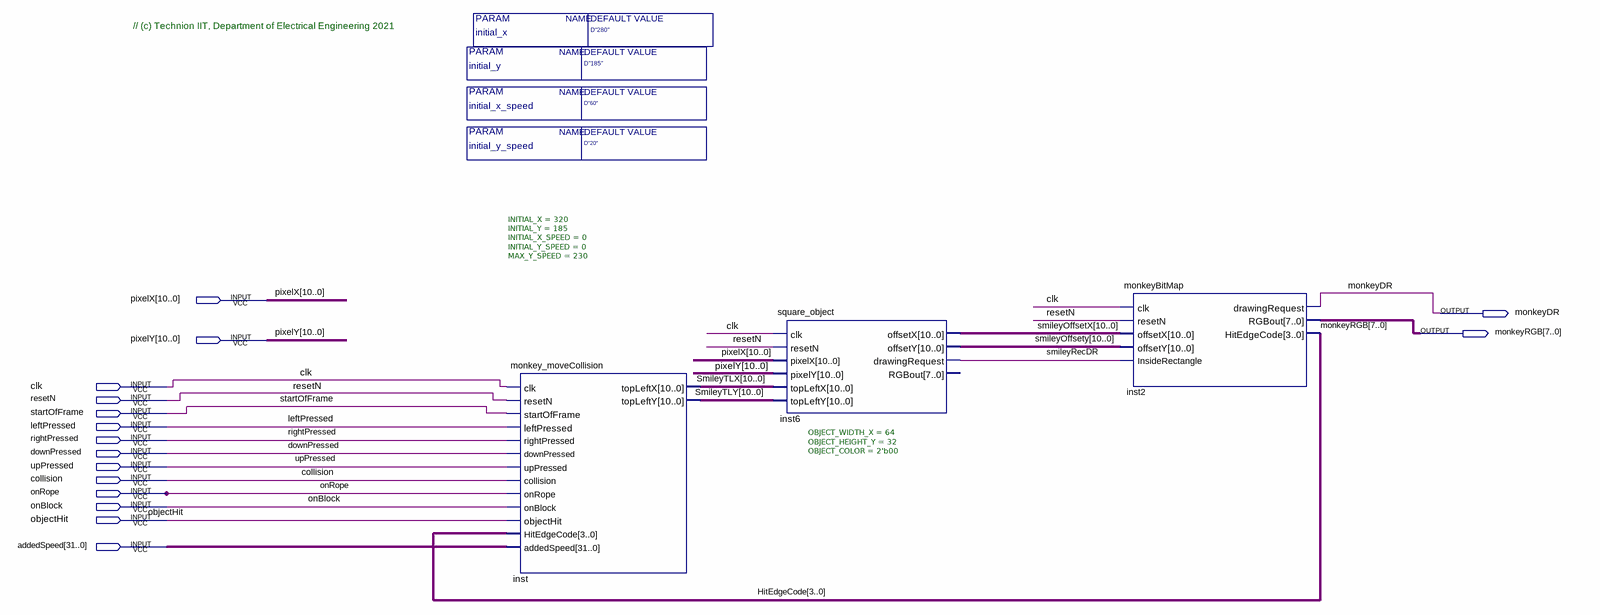
[diagram p0: schematic sheet]
// Quartus schematic monkey_block.bdf as structural Verilog: 3 symbols, 16 pins
module monkey_block #(parameter initial_x = "D\"280\"", parameter initial_y = "D\"185\"", parameter initial_x_speed = "D\"60\"", parameter initial_y_speed = "D\"20\"") (
  input  [10:0] pixelX,
  input  [10:0] pixelY,
  input  clk,
  input  resetN,
  input  startOfFrame,
  input  leftPressed,
  input  rightPressed,
  input  downPressed,
  input  upPressed,
  input  collision,
  input  onRope,
  input  onBlock,
  input  objectHit,
  input  [31:0] addedSpeed,
  output monkeyDR,
  output [7:0] monkeyRGB
);

  wire smileyRecDR;
  wire [3:0] HitEdgeCode;
  wire [10:0] smileyOffsetX, smileyOffsety, SmileyTLX, SmileyTLY;

  monkey_moveCollision #(.INITIAL_X(320), .INITIAL_Y(185), .INITIAL_X_SPEED(0), .INITIAL_Y_SPEED(0), .MAX_Y_SPEED(230)) inst (
    .clk(clk), .resetN(resetN), .startOfFrame(startOfFrame), .leftPressed(leftPressed),
    .rightPressed(rightPressed), .downPressed(downPressed), .upPressed(upPressed), .collision(collision),
    .onRope(onRope), .onBlock(onBlock), .objectHit(objectHit), .HitEdgeCode(HitEdgeCode),
    .addedSpeed(addedSpeed), .topLeftX(SmileyTLX), .topLeftY(SmileyTLY));
  square_object #(.OBJECT_WIDTH_X(64), .OBJECT_HEIGHT_Y(32), .OBJECT_COLOR(2'b00)) inst6 (
    .clk(clk), .resetN(resetN), .pixelX(pixelX), .pixelY(pixelY), .topLeftX(SmileyTLX), .topLeftY(SmileyTLY),
    .offsetX(smileyOffsetX), .offsetY(smileyOffsety), .drawingRequest(smileyRecDR));  // open: RGBout
  monkeyBitMap inst2 (
    .clk(clk), .resetN(resetN), .offsetX(smileyOffsetX), .offsetY(smileyOffsety),
    .InsideRectangle(smileyRecDR), .drawingRequest(monkeyDR), .RGBout(monkeyRGB), .HitEdgeCode(HitEdgeCode));

  // Notes on the sheet:
  //   // (c) Technion IIT, Department of Electrical Engineering 2021
endmodule
